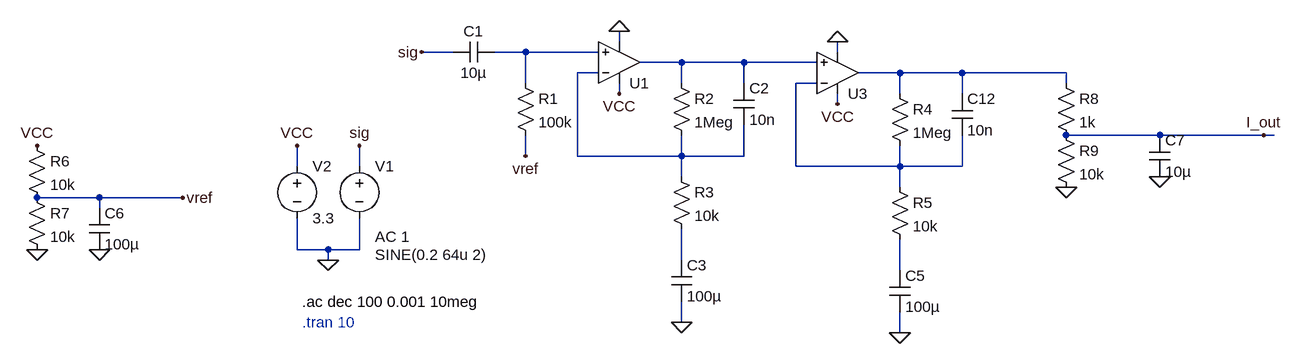
[diagram p0: schematic IF_amp_V5_eand.asc]
IF_amp_V5_eand.asc, the LTspice schematic file:
Version 4.1
SHEET 1 1328 960
WIRE 288 32 288 16
WIRE 32 48 -16 48
WIRE 144 48 96 48
WIRE 256 48 144 48
WIRE 624 48 624 32
WIRE 384 64 320 64
WIRE 480 64 384 64
WIRE 592 64 480 64
WIRE 256 80 224 80
WIRE 720 80 656 80
WIRE 816 80 720 80
WIRE 976 80 816 80
WIRE 144 96 144 48
WIRE 384 96 384 64
WIRE 480 96 480 64
WIRE 592 96 560 96
WIRE 976 96 976 80
WIRE 288 112 288 96
WIRE 720 112 720 80
WIRE 816 112 816 80
WIRE 624 128 624 112
WIRE 1120 176 976 176
WIRE 1280 176 1120 176
WIRE 1296 176 1280 176
WIRE 144 208 144 176
WIRE 224 208 224 80
WIRE 384 208 384 176
WIRE 384 208 224 208
WIRE 480 208 480 160
WIRE 480 208 384 208
WIRE -208 224 -208 192
WIRE -112 224 -112 192
WIRE 560 224 560 96
WIRE 720 224 720 192
WIRE 720 224 560 224
WIRE 816 224 816 176
WIRE 816 224 720 224
WIRE 384 240 384 208
WIRE 720 256 720 224
WIRE -512 272 -608 272
WIRE -384 272 -512 272
WIRE -512 288 -512 272
WIRE -208 352 -208 304
WIRE -160 352 -208 352
WIRE -112 352 -112 304
WIRE -112 352 -160 352
WIRE -160 368 -160 352
WIRE 384 368 384 320
WIRE 720 384 720 336
WIRE 384 464 384 432
WIRE 720 480 720 448
FLAG 288 16 0
FLAG 288 112 VCC
FLAG 144 208 vref
FLAG 384 464 0
FLAG -16 48 sig
FLAG -160 368 0
FLAG -112 192 sig
FLAG -208 192 VCC
FLAG 624 32 0
FLAG 624 128 VCC
FLAG 720 480 0
FLAG -608 352 0
FLAG -608 192 VCC
FLAG -512 352 0
FLAG -384 272 vref
FLAG 976 256 0
FLAG 1120 240 0
FLAG 1280 176 I_out
SYMBOL cap 96 32 R90
WINDOW 0 0 32 VBottom 2
WINDOW 3 32 32 VTop 2
SYMATTR InstName C1
SYMATTR Value 10µ
SYMBOL res 128 80 R0
SYMATTR InstName R1
SYMATTR Value 100k
SYMBOL res 368 80 R0
SYMATTR InstName R2
SYMATTR Value 1Meg
SYMBOL res 368 224 R0
SYMATTR InstName R3
SYMATTR Value 10k
SYMBOL cap 368 368 R0
SYMATTR InstName C3
SYMATTR Value 100µ
SYMBOL voltage -112 208 R0
WINDOW 3 24 152 Left 2
WINDOW 123 24 124 Left 2
WINDOW 39 0 0 Left 0
SYMATTR Value SINE(0.2 64u 2)
SYMATTR Value2 AC 1
SYMATTR InstName V1
SYMBOL voltage -208 208 R0
WINDOW 123 0 0 Left 0
WINDOW 39 0 0 Left 0
SYMATTR InstName V2
SYMATTR Value 3.3
SYMBOL res 704 96 R0
SYMATTR InstName R4
SYMATTR Value 1Meg
SYMBOL res 704 240 R0
SYMATTR InstName R5
SYMATTR Value 10k
SYMBOL cap 704 384 R0
SYMATTR InstName C5
SYMATTR Value 100µ
SYMBOL res -624 176 R0
SYMATTR InstName R6
SYMATTR Value 10k
SYMBOL res -624 256 R0
SYMATTR InstName R7
SYMATTR Value 10k
SYMBOL cap -528 288 R0
SYMATTR InstName C6
SYMATTR Value 100µ
SYMBOL cap 464 96 R0
SYMATTR InstName C2
SYMATTR Value 10n
SYMBOL cap 800 112 R0
SYMATTR InstName C12
SYMATTR Value 10n
SYMBOL OpAmps\\UniversalOpAmp 288 64 M180
SYMATTR InstName U1
SYMATTR Value2 Avol=3.16e5 GBW=2Meg Vos=3e-3
SYMATTR SpiceLine En=20e-9 Enk=346e-9 In=3e-15 Ink=0 Rin=500Meg
SYMBOL OpAmps\\UniversalOpAmp 624 80 M180
SYMATTR InstName U3
SYMATTR Value2 Avol=3.16e5 GBW=2Meg Vos=3e-3
SYMATTR SpiceLine En=20e-9 Enk=346e-9 In=3e-15 Ink=0 Rin=500Meg
SYMBOL res 960 80 R0
SYMATTR InstName R8
SYMATTR Value 1k
SYMBOL res 960 160 R0
SYMATTR InstName R9
SYMATTR Value 10k
SYMBOL cap 1104 176 R0
SYMATTR InstName C7
SYMATTR Value 10µ
TEXT -200 432 Left 2 !.ac dec 100 0.001 10meg
TEXT -200 464 Left 2 ;.tran 10

The netlist it stands for:
* IF_amp_V5_eand.asc
C1 N001 sig 10µ
R1 N001 vref 100k
R2 N002 N003 1Meg
R3 N003 N006 10k
C3 N006 0 100µ
V1 sig 0 SINE(0.2 64u 2) AC 1
V2 VCC 0 3.3
R4 N004 N005 1Meg
R5 N005 N007 10k
C5 N007 0 100µ
R6 VCC vref 10k
R7 vref 0 10k
C6 vref 0 100µ
C2 N002 N003 10n
C12 N004 N005 10n
X§U1 N001 N003 VCC 0 N002 level1 Avol=3.16e5 GBW=2Meg Vos=3e-3 En=20e-9 Enk=346e-9 In=3e-15 Ink=0 Rin=500Meg  ; pins In+ In- V+ V- OUT
X§U3 N002 N005 VCC 0 N004 level1 Avol=3.16e5 GBW=2Meg Vos=3e-3 En=20e-9 Enk=346e-9 In=3e-15 Ink=0 Rin=500Meg  ; pins In+ In- V+ V- OUT
R8 N004 I_out 1k
R9 I_out 0 10k
C7 I_out 0 10µ
.ac dec 100 0.001 10meg
* .tran 10
.lib UniversalOpAmp1.lib
.backanno
.end